# EAGLE design BigLCD_final_rev02 (EAGLE 9.6.2)
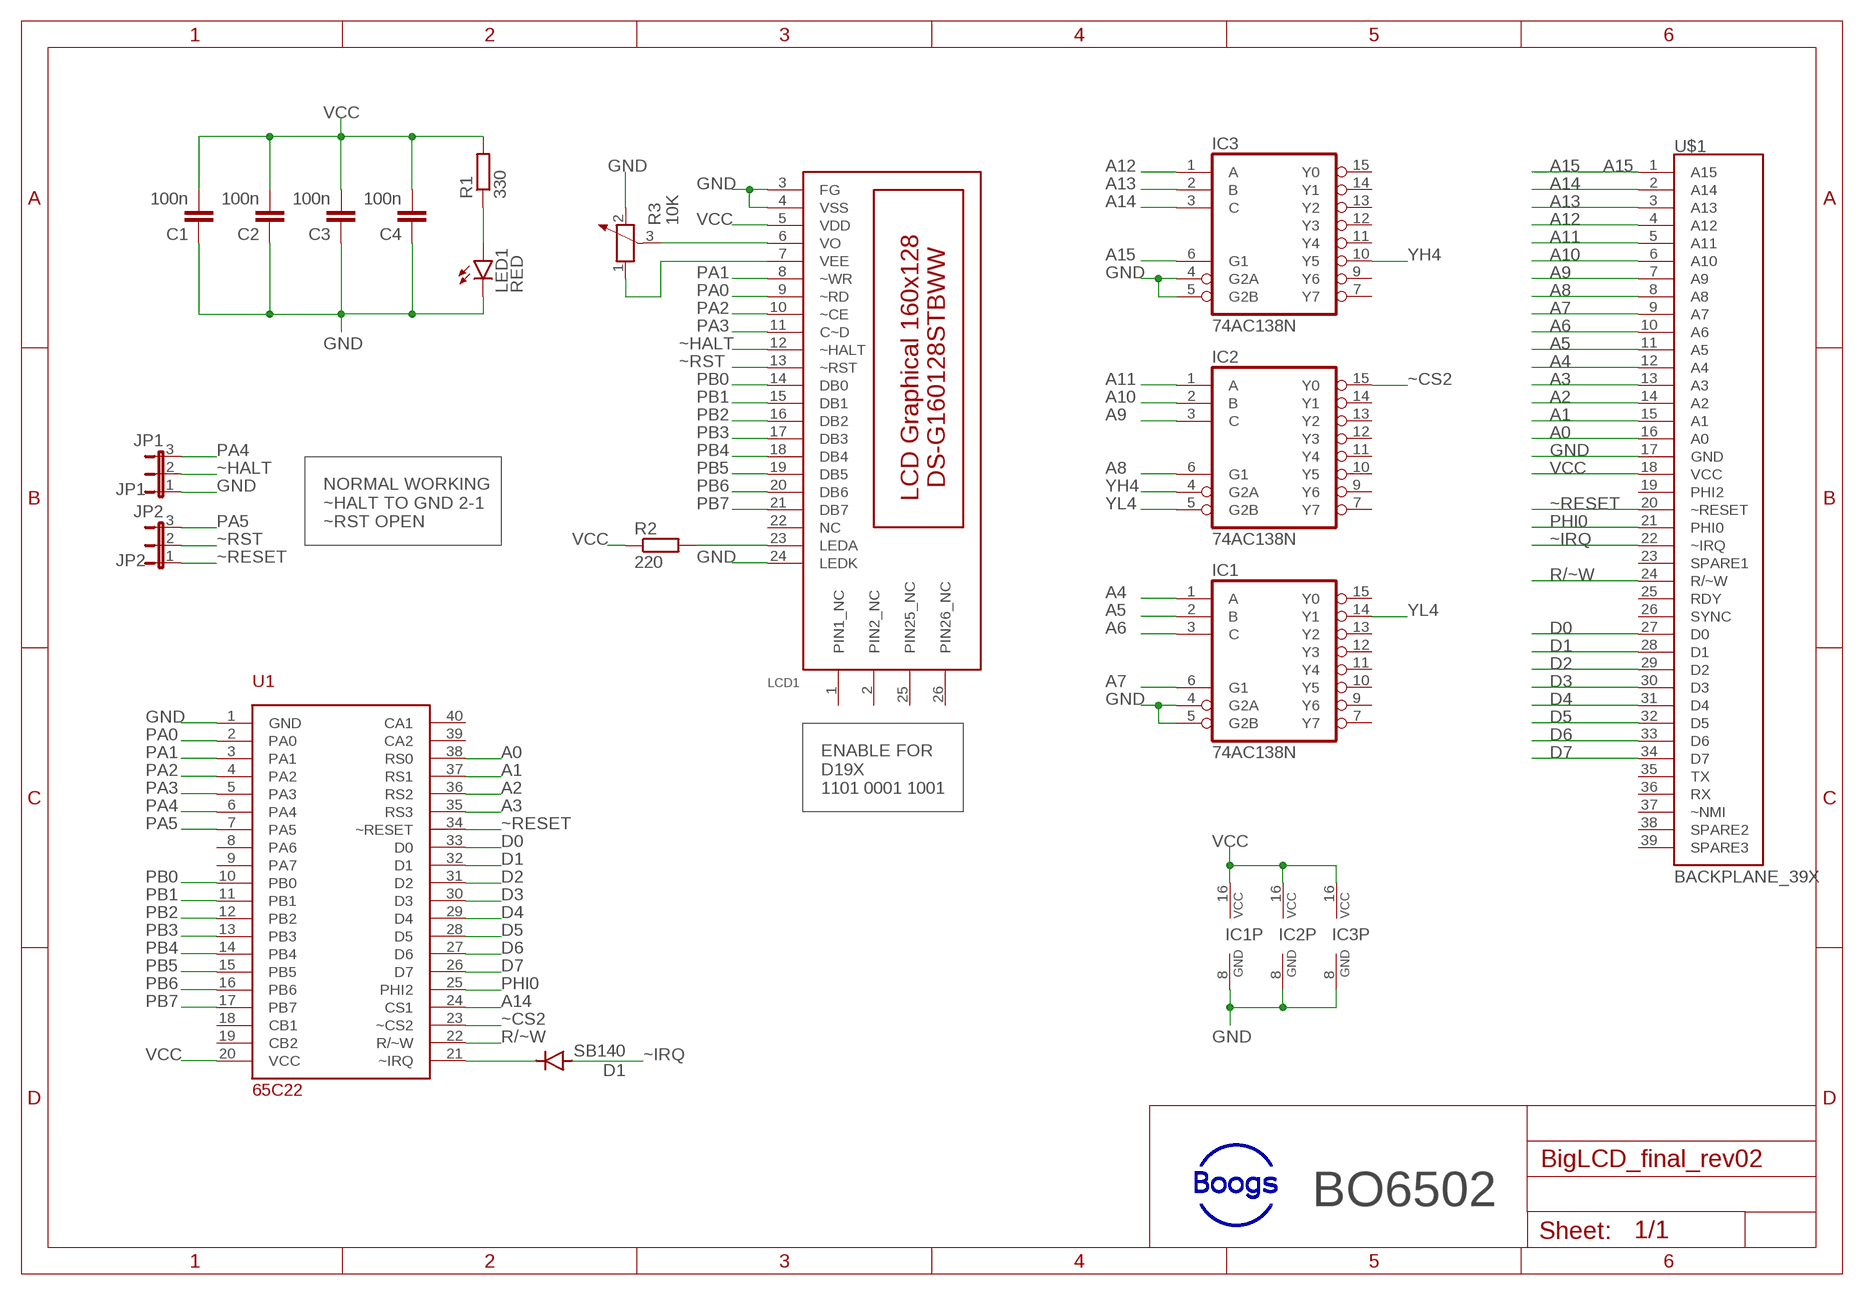
[diagram p0: schematic, sheet 1]

## Parts
C1  100n  C-EU025-025X050  [C025-025X050]
C2  100n  C-EU025-025X050  [C025-025X050]
C3  100n  C-EU025-025X050  [C025-025X050]
C4  100n  C-EU025-025X050  [C025-025X050]
D1  SB140  1N4004  [DO41-10]
IC1  74AC138N  [DIL16]
IC2  74AC138N  [DIL16]
IC3  74AC138N  [DIL16]
JP1  JP1  JP2E  [JP2]
JP2  JP2  JP2E  [JP2]
LCD1  DS-G160128STBWW  [PAK100/2500-26]
LED1  RED  LED5MM  [LED5MM]
R1  330  R-EU_0207/10  [0207/10]
R2  220  R-EU_0207/10  [0207/10]
R3  10K  POTENTIOMETER_PT-10  [PT-10]
U1  65C22  [DIL40]
U$1  BACKPLANE_39X  [BP_39X]

## Nets
A0: U1.38(RS0) U$1.16(A0)
A1: U1.37(RS1) U$1.15(A1)
A2: U1.36(RS2) U$1.14(A2)
A3: U1.35(RS3) U$1.13(A3)
A4: IC1.1(A) U$1.12(A4)
A5: IC1.2(B) U$1.11(A5)
A6: IC1.3(C) U$1.10(A6)
A7: IC1.6(G1) U$1.9(A7)
A8: IC2.6(G1) U$1.8(A8)
A9: IC2.3(C) U$1.7(A9)
A10: IC2.2(B) U$1.6(A10)
A11: IC2.1(A) U$1.5(A11)
A12: IC3.1(A) U$1.4(A12)
A13: IC3.2(B) U$1.3(A13)
A14: IC3.3(C) U1.24(CS1) U$1.2(A14)
A15: IC3.6(G1) U$1.1(A15)
D0: U1.33(D0) U$1.27(D0)
D1: U1.32(D1) U$1.28(D1)
D2: U1.31(D2) U$1.29(D2)
D3: U1.30(D3) U$1.30(D3)
D4: U1.29(D4) U$1.31(D4)
D5: U1.28(D5) U$1.32(D5)
D6: U1.27(D6) U$1.33(D6)
D7: U1.26(D7) U$1.34(D7)
GND: C1.1 C2.1 C3.1 C4.1 IC1.4(G2A) IC1.5(G2B) IC1.8(GND) IC2.8(GND) IC3.4(G2A) IC3.5(G2B) IC3.8(GND) JP1.1 LCD1.3(FG) LCD1.4(VSS) LCD1.24(LEDK) LED1.K(C) R3.2 U1.1(GND) U$1.17(GND)
N$1: D1.C U1.21(~IRQ)
N$2: LCD1.6(VO) R3.3
N$3: LCD1.7(VEE) R3.1
N$4: LCD1.23(LEDA) R2.2
N$6: LED1.A R1.1
PA0: LCD1.9(~RD) U1.2(PA0)
PA1: LCD1.8(~WR) U1.3(PA1)
PA2: LCD1.10(~CE) U1.4(PA2)
PA3: LCD1.11(C~D) U1.5(PA3)
PA4: JP1.3 U1.6(PA4)
PA5: JP2.3 U1.7(PA5)
PB0: LCD1.14(DB0) U1.10(PB0)
PB1: LCD1.15(DB1) U1.11(PB1)
PB2: LCD1.16(DB2) U1.12(PB2)
PB3: LCD1.17(DB3) U1.13(PB3)
PB4: LCD1.18(DB4) U1.14(PB4)
PB5: LCD1.19(DB5) U1.15(PB5)
PB6: LCD1.20(DB6) U1.16(PB6)
PB7: LCD1.21(DB7) U1.17(PB7)
PHI0: U1.25(PHI2) U$1.21(PHI0)
R/~W: U1.22(R/~W) U$1.24(R/~W)
VCC: C1.2 C2.2 C3.2 C4.2 IC1.16(VCC) IC2.16(VCC) IC3.16(VCC) LCD1.5(VDD) R1.2 R2.1 U1.20(VCC) U$1.18(VCC)
YH4: IC2.4(G2A) IC3.10(Y5)
YL4: IC1.14(Y1) IC2.5(G2B)
~CS2: IC2.15(Y0) U1.23(~CS2)
~HALT: JP1.2 LCD1.12(~HALT)
~IRQ: D1.A U$1.22(~IRQ)
~RESET: JP2.1 U1.34(~RESET) U$1.20(~RESET)
~RST: JP2.2 LCD1.13(~RST)
Unconnected: IC1.7(Y7) IC1.9(Y6) IC1.10(Y5) IC1.11(Y4) IC1.12(Y3) IC1.13(Y2) IC1.15(Y0) IC2.7(Y7) IC2.9(Y6) IC2.10(Y5) IC2.11(Y4) IC2.12(Y3) IC2.13(Y2) IC2.14(Y1) IC3.7(Y7) IC3.9(Y6) IC3.11(Y4) IC3.12(Y3) IC3.13(Y2) IC3.14(Y1) IC3.15(Y0) LCD1.1(PIN1_NC) LCD1.2(PIN2_NC) LCD1.22(NC) LCD1.25(PIN25_NC) LCD1.26(PIN26_NC) U1.8(PA6) U1.9(PA7) U1.18(CB1) U1.19(CB2) U1.39(CA2) U1.40(CA1) U$1.19(PHI2) U$1.23(SPARE1) U$1.25(RDY) U$1.26(SYNC) U$1.35(TX) U$1.36(RX) U$1.37(~NMI) U$1.38(SPARE2) U$1.39(SPARE3)

## Notes on the sheet
- NORMAL WORKING
  ~HALT TO GND 2-1
  ~RST OPEN
- ENABLE FOR
  D19X
  1101 0001 1001
- BO6502

## Library data of the parts
C1-C4 = rcl:C-EU: CAPACITOR, European symbol; SPICEPREFIX: C
D1 = diode:1N4004: DIODE general purpose rectifier, 1 A
IC1-IC3 = 74xx-eu:74*138: 3-line to 8-line DECODER/DEMULTIPLEXER
JP1 JP2 = jumper:JP2E: JUMPER
LCD1 = 65xx_family:DS-G160128STBWW
LED1 = led:LED: LED OSRAM: - CHIPLED LG R971, LG N971, LY N971, LG Q971, LY Q971, LO R971, LY R971 LH N974, LH R974 LS Q976, LO Q976, LY Q976 LO Q996 - Hyper CHIPLED LW Q18S LB Q993, LB Q99A, LB R99A - SideLED LS A670, LO A670, LY A670, LG A670, LP A670 LB A673, LV A673, LT A673, LW A673 LH A674 LY A675 LS A676, LA A676, LO A676, LY A676, LW A676 LS A679, LY A679, LG A679 - Hyper Micro SIDELED® LS Y876, LA Y876, LO Y876, LY Y876 LT Y87S - SmartLED LW L88C, LW L88S LB L89C, LB L89S, LG L890 LS L89K, LO L89K, LY L89K LS L896, LA L896, LO L896, LY L896 - TOPLED LS T670, LO T670, LY T670, LG T670, LP T670 LSG T670, LSP T670, LSY T670, LOP T670, LYG T670 LG T671, LOG T671, LSG T671 LB T673, LV T673, LT T673, LW T673 LH T674 LS T676, LA T676, LO T676, LY T676, LB T676, LH T676, LSB T676, LW T676 LB T67C, LV T67C, LT T67C, LS T67K, LO T67K, LY T67K, LW E67C LS E67B, LA E67B, LO E67B, LY E67B, LB E67C, LV E67C, LT E67C LW T67C LS T679, LY T679, LG T679 LS T770, LO T770, LY T770, LG T770, LP T770 LB T773, LV T773, LT T773, LW T773 LH T774 LS E675, LA E675, LY E675, LS T675 LS T776, LA T776, LO T776, LY T776, LB T776 LHGB T686 LT T68C, LB T68C - Hyper Mini TOPLED® LB M676 - Mini TOPLED Santana® LG M470 LS M47K, LO M47K, LY M47K Source: http://www.osram.convergy.de LUXEON: - LUMILED® LXK2-PW12-R00, LXK2-PW12-S00, LXK2-PW14-U00, LXK2-PW14-V00 LXK2-PM12-R00, LXK2-PM12-S00, LXK2-PM14-U00 LXK2-PE12-Q00, LXK2-PE12-R00, LXK2-PE12-S00, LXK2-PE14-T00, LXK2-PE14-U00 LXK2-PB12-K00, LXK2-PB12-L00, LXK2-PB12-M00, LXK2-PB14-N00, LXK2-PB14-P00, LXK2-PB14-Q00 LXK2-PR12-L00, LXK2-PR12-M00, LXK2-PR14-Q00, LXK2-PR14-R00 LXK2-PD12-Q00, LXK2-PD12-R00, LXK2-PD12-S00 LXK2-PH12-R00, LXK2-PH12-S00 LXK2-PL12-P00, LXK2-PL12-Q00, LXK2-PL12-R00 Source: www.luxeon.com KINGBRIGHT: KA-3528ASYC Source: www.kingbright.com
R1 R2 = rcl:R-EU_: RESISTOR, European symbol; SPICEPREFIX: R
R3 = rcl:POTENTIOMETER_: Potentiometer; SPICEMODEL: POT; SPICEPREFIX: X
U1 = 65xx_family:65C22
U$1 = 65xx_family:BACKPLANE_39X; A15: A15

## Board
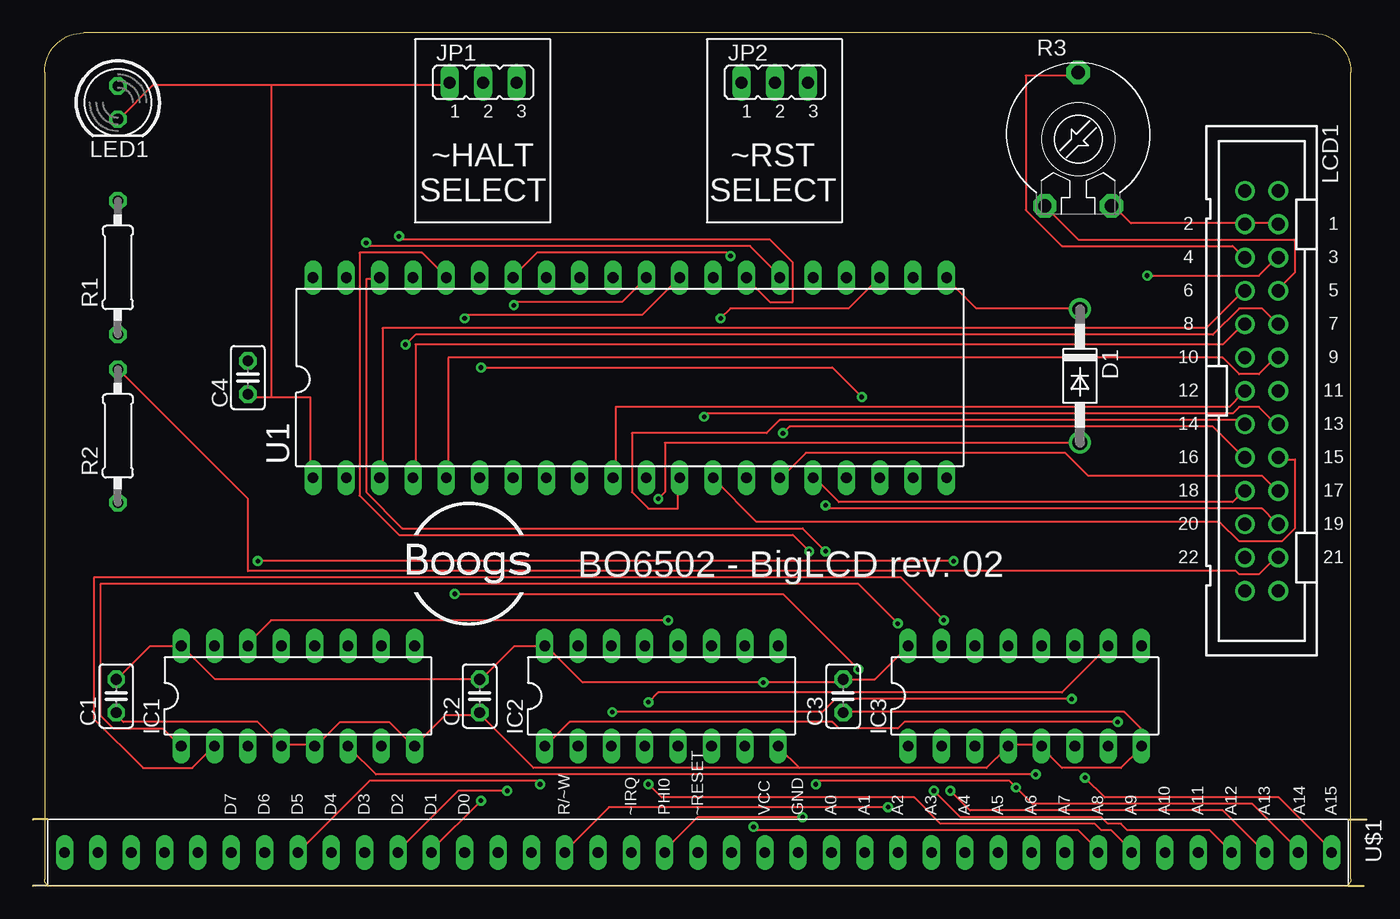
[diagram p1: board, top side]
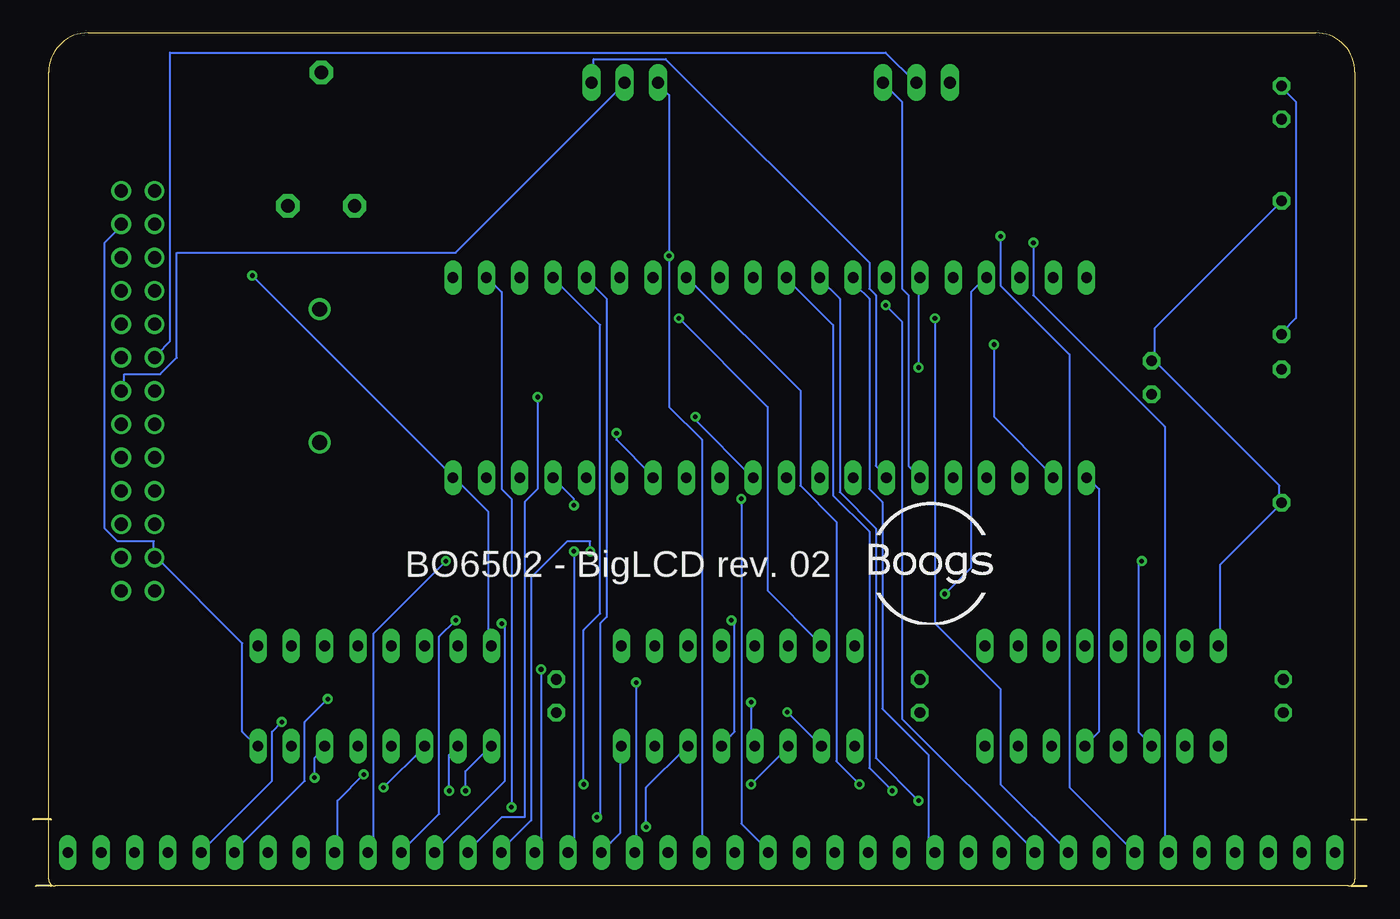
[diagram p2: board, bottom side, seen from below]

Size 101.6 x 65 mm. Coordinates in mm from the lower left corner, seen from the top.
Outline: 1.14,5.08 0,5.08
Outline: 1.14,0 0,0
Outline: 100.2,5.08 101.6,5.08
Outline: 100.2,0 101.35,0
Outline: 1.39,0 99.89,0 arc90 100.39,0.5 100.39,62 arc90 97.39,65 3.89,65 arc90 0.89,62 0.89,0.5 arc90 1.39,0
Copper layers (1*16): Top 0.035mm / dielectric 1.5mm / Bottom 0.035mm
Design rules "default *": minimum track width 6mil, minimum drill 0.35mm, track to track 10mil, track to pad 10mil, pad to pad 10mil, via to via 10mil, smd to smd 6mil, copper to edge 40mil, drill to drill 6mil, minimum pad ring 10mil, minimum via ring 8mil, stop-mask expansion 4mil, vias tented up to drill 15mil, thermal gap 10mil

### Footprints (pad centres in the part's own frame; a part is rotated, then mirrored left to right if it is on the bottom)
C025-025X050 = drill 0.813 octagon: 1 -1.27,0; 2 1.27,0
DO41-10 = drill 1.118: A 5.08,0; C -5.08,0
DIL16 = drill 0.813 long: 1 -8.89,-3.81; 2 -6.35,-3.81; 3 -3.81,-3.81; 4 -1.27,-3.81; 5 1.27,-3.81; 6 3.81,-3.81; 7 6.35,-3.81; 8 8.89,-3.81; 9 8.89,3.81; 10 6.35,3.81; 11 3.81,3.81; 12 1.27,3.81; 13 -1.27,3.81; 14 -3.81,3.81; 15 -6.35,3.81; 16 -8.89,3.81
JP2 = drill 0.914 long: 1 -2.54,0; 2 0,0; 3 2.54,0
PAK100/2500-26 = drill 1 pad 1.422: 1 -15.24,1.27; 2 -15.24,-1.27; 3 -12.7,1.27; 4 -12.7,-1.27; 5 -10.16,1.27; 6 -10.16,-1.27; 7 -7.62,1.27; 8 -7.62,-1.27; 9 -5.08,1.27; 10 -5.08,-1.27; 11 -2.54,1.27; 12 -2.54,-1.27; 13 0,1.27; 14 0,-1.27; 15 2.54,1.27; 16 2.54,-1.27; 17 5.08,1.27; 18 5.08,-1.27; 19 7.62,1.27; 20 7.62,-1.27; 21 10.16,1.27; 22 10.16,-1.27; 23 12.7,1.27; 24 12.7,-1.27; 25 15.24,1.27; 26 15.24,-1.27
LED5MM = drill 0.813 octagon: A -1.27,0; K 1.27,0
0207/10 = drill 0.813 octagon: 1 -5.08,0; 2 5.08,0
PT-10 = drill 1.016 pad 1.778 octagon: 1 -2.54,-5.08; 2 2.54,-5.08; 3 0,5.08
DIL40 = drill 0.813 long: 1 -24.13,-7.62; 2 -21.59,-7.62; 3 -19.05,-7.62; 4 -16.51,-7.62; 5 -13.97,-7.62; 6 -11.43,-7.62; 7 -8.89,-7.62; 8 -6.35,-7.62; 9 -3.81,-7.62; 10 -1.27,-7.62; 11 1.27,-7.62; 12 3.81,-7.62; 13 6.35,-7.62; 14 8.89,-7.62; 15 11.43,-7.62; 16 13.97,-7.62; 17 16.51,-7.62; 18 19.05,-7.62; 19 21.59,-7.62; 20 24.13,-7.62; 21 24.13,7.62; 22 21.59,7.62; 23 19.05,7.62; 24 16.51,7.62; 25 13.97,7.62; 26 11.43,7.62; 27 8.89,7.62; 28 6.35,7.62; 29 3.81,7.62; 30 1.27,7.62; 31 -1.27,7.62; 32 -3.81,7.62; 33 -6.35,7.62; 34 -8.89,7.62; 35 -11.43,7.62; 36 -13.97,7.62; 37 -16.51,7.62; 38 -19.05,7.62; 39 -21.59,7.62; 40 -24.13,7.62
BP_39X = drill 0.813 long: 1 1.27,59.69; 2 1.27,57.15; 3 1.27,54.61; 4 1.27,52.07; 5 1.27,49.53; 6 1.27,46.99; 7 1.27,44.45; 8 1.27,41.91; 9 1.27,39.37; 10 1.27,36.83; 11 1.27,34.29; 12 1.27,31.75; 13 1.27,29.21; 14 1.27,26.67; 15 1.27,24.13; 16 1.27,21.59; 17 1.27,19.05; 18 1.27,16.51; 19 1.27,13.97; 20 1.27,11.43; 21 1.27,8.89; 22 1.27,6.35; 23 1.27,3.81; 24 1.27,1.27; 25 1.27,-1.27; 26 1.27,-3.81; 27 1.27,-6.35; 28 1.27,-8.89; 29 1.27,-11.43; 30 1.27,-13.97; 31 1.27,-16.51; 32 1.27,-19.05; 33 1.27,-21.59; 34 1.27,-24.13; 35 1.27,-26.67; 36 1.27,-29.21; 37 1.27,-31.75; 38 1.27,-34.29; 39 1.27,-36.83

### Placement (x,y rotation side)
C1  6.35,14.48 90 top
C2  34.04,14.48 90 top
C3  61.72,14.48 90 top
C4  16.38,38.73 90 top
D1  79.76,38.86 270 top
IC1  20.19,14.48 0 top
IC2  47.88,14.48 0 top
IC3  75.56,14.48 0 top
JP1  34.29,61.21 0 top
JP2  56.52,61.21 0 top
LCD1  93.6,37.72 270 top
LED1  6.48,59.69 270 top
R1  6.48,47.12 90 top
R2  6.48,34.29 90 top
R3  79.63,56.9 0 top
U1  45.47,38.73 0 top
U$1  39.24,3.81 270 top

### Tracks (layer width: path | path; a pad name or v marks a point on that pad's centre or on a via)
A0  (via drill 0.35)
  Top 0.152: v60.39,25.5 58.64,27.25 28.14,27.25 25.39,30 25.39,46.25 26.39,46.25 U1.38
  Bottom 0.152: v60.39,25.5 60.39,3 60.64,2.75 U$1.16
A1  (via drill 0.35)
  Top 0.152: v62.89,16.5 57.14,22.25 v32.14,22.25
  Bottom 0.152: v62.89,16.5 62.89,3 63.14,2.75 U$1.15 | v32.14,22.25 30.14,24.25 30.14,45.25 29.14,46.25 U1.37
A2  (via drill 0.35)
  Top 0.152: v59.14,25.5 57.89,26.75 27.89,26.75 24.89,29.75 24.89,48.25 29.64,48.25 31.39,46.5 U1.36
  Bottom 0.152: v59.14,25.5 59.14,26.25 60.89,26.25 63.64,23.5 63.64,5 65.89,2.75 U$1.14
A3  (via drill 0.35)
  Top 0.152: v63.14,37.25 60.89,39.5 v34.14,39.5
  Bottom 0.152: v63.14,37.25 63.14,30.25 64.14,29.25 64.14,5.25 65.89,5.25 68.39,2.75 U$1.13 | v34.14,39.5 34.14,46.25 U1.35
A4  (via drill 0.35)
  Top 0.152: v65.89,20 62.89,23 5.14,23 5.14,13 6.14,12 9.89,12 11.14,10.75 IC1.1
  Bottom 0.152: v65.89,20 65.64,19.75 65.64,8 70.89,2.75 U$1.12
A5  (via drill 0.35)
  Top 0.152: v69.39,20.25 66.14,23.5 4.64,23.5 4.64,12.75 8.39,9 12.14,9 13.64,10.5 IC1.2
  Bottom 0.152: v69.39,20.25 70.64,19 70.64,5.5 73.39,2.75 U$1.11
A6  (via drill 0.35)
  Top 0.152: v70.14,24.75 v17.14,24.75
  Bottom 0.152: v17.14,24.75 17.39,24.5 17.39,11.75 16.39,10.75 IC1.3 | v70.14,24.75 75.64,19.25 75.64,3 75.89,2.75 U$1.10
A7  (via drill 0.35)
  Top 0.152: v76.39,8.5 26.14,8.5 24.14,10.5 IC1.6
  Bottom 0.152: v76.39,8.5 78.39,6.5 78.39,2.75 U$1.9
A8  (via drill 0.35)
  Top 0.152: v54.89,4.5 55.14,4.25 79.64,4.25 81.14,2.75 U$1.8
  Bottom 0.152: v54.89,4.5 54.89,7.5 51.89,10.5 IC2.6
A9  (via drill 0.35)
  Top 0.152: v46.89,7.75 47.89,6.75 67.14,6.75 69.14,4.75 80.89,4.75 81.39,4.25 82.14,4.25 83.64,2.75 U$1.7
  Bottom 0.152: v46.89,7.75 44.14,10.5 IC2.3
A10  (via drill 0.35)
  Top 0.152: v44.14,13.25 60.14,13.25 61.14,14.25 v79.14,14.25
  Bottom 0.152: v44.14,13.25 41.64,10.75 IC2.2 | v79.14,14.25 80.89,12.5 80.89,8 86.14,2.75 U$1.6
A11  (via drill 0.35)
  Top 0.152: v82.64,12.5 66.39,12.5 65.89,12 61.39,12 60.89,12.5 40.89,12.5 39.14,10.75 IC2.1
  Bottom 0.152: v82.64,12.5 83.39,11.75 83.39,8 88.64,2.75 U$1.5
A12  (via drill 0.35)
  Top 0.152: v68.64,7.25 70.64,5.25 81.39,5.25 81.89,4.75 82.89,4.75 83.39,4.25 89.64,4.25 91.14,2.75 U$1.4
  Bottom 0.152: v68.64,7.25 68.64,8.75 66.89,10.5 IC3.1
A13  (via drill 0.35)
  Top 0.152: v69.89,7.25 71.39,5.75 90.64,5.75 93.64,2.75 U$1.3
  Bottom 0.152: v69.89,7.25 69.89,10 69.39,10.5 IC3.2
A14  (via drill 0.35)
  Top 0.152: U$1.2 96.39,2.75 92.89,6.25 76.14,6.25 v74.89,7.5 74.39,8 59.89,8 v59.64,7.75
  Bottom 0.152: v74.89,7.5 71.89,10.5 IC3.3 | v59.64,7.75 59.64,19.5 58.39,20.75 58.39,42.75 61.89,46.25 U1.24
A15  (via drill 0.35)
  Top 0.152: v80.14,8.25 81.64,6.75 94.89,6.75 98.89,2.75 U$1.1
  Bottom 0.152: v80.14,8.25 80.14,9.75 79.39,10.5 IC3.6
D0
  Bottom 0.152: U$1.27 33.14,2.75 33.39,3 33.39,10 36.89,13.5 36.89,29.25 37.89,30.25 37.89,44.75 38.89,45.75 38.89,46.25 U1.33
D1  (via drill 0.35)
  Top 0.152: v34.14,6.5 30.39,2.75 U$1.28
  Bottom 0.152: v34.14,6.5 37.39,9.75 37.39,27.25 40.14,30 40.14,44.75 41.64,46.25 U1.32
D2  (via drill 0.35)
  Top 0.152: v36.14,7.25 32.39,7.25 27.89,2.75 U$1.29
  Bottom 0.152: v36.14,7.25 37.89,9 37.89,27 40.64,29.75 40.64,42.75 44.14,46.25 U1.31
D3  (via drill 0.35)
  Top 0.152: v36.64,44.25 36.89,44.5 44.89,44.5 46.64,46.25 U1.30
  Bottom 0.152: v36.64,44.25 35.39,43 35.39,12.75 25.39,2.75 U$1.30
D4  (via drill 0.35)
  Top 0.152: v32.89,43.25 33.14,43.5 46.39,43.5 49.14,46.25 U1.29
  Bottom 0.152: v32.89,43.25 32.89,20 27.89,15 27.89,7.75 22.89,2.75 U$1.31
D5  (via drill 0.35)
  Top 0.152: v38.64,7.75 38.39,8 25.64,8 20.39,2.75 U$1.32
  Bottom 0.152: v38.64,7.75 40.39,9.5 40.39,27.75 43.14,30.5 43.14,37.75 51.64,46.25 U1.28
D6  (via drill 0.35)
  Top 0.152: v27.89,49.5 28.14,49.25 56.14,49.25 57.89,47.5 57.89,44.5 56.14,44.5 54.39,46.25 U1.27
  Bottom 0.152: v27.89,49.5 27.89,45.75 22.64,40.5 22.64,7.5 17.89,2.75 U$1.33
D7  (via drill 0.35)
  Top 0.152: v25.39,49 25.64,48.75 54.64,48.75 56.89,46.5 U1.26
  Bottom 0.152: v25.39,49 25.39,45 15.39,35 15.39,3 15.14,2.75 U$1.34
GND
  Top 0.152: C1.1 6.39,13 6.89,12.5 17.14,12.5 18.89,10.75 IC1.4 19.14,10.75 21.39,10.75 IC1.5 21.64,10.75 23.39,12.5 27.14,12.5 28.89,10.75 IC1.8 29.14,10.75 31.39,13 33.89,13 C2.1 34.14,13 38.14,9 58.39,9 | 18.14,37.25 16.39,37.25 C4.1 | 18.14,37.25 21.14,37.25 21.14,31.25 U1.1 | 18.14,61 31.64,61 JP1.1 | 18.14,61 9.14,61 6.64,58.5 LED1.K | 18.14,61 18.14,37.25 | LCD1.3 94.64,50.5 92.39,50.5 LCD1.4 92.14,50.5 83.64,50.5 82.39,51.75 R3.2 | C3.1 61.89,13.25 83.14,13.25 84.39,12 84.39,10.75 IC3.8 84.39,10.5 82.89,9 78.39,9 76.89,10.5 IC3.5 76.64,10.75 74.39,10.75 IC3.4 74.14,10.5 72.64,9 58.39,9 | 58.39,9 56.89,10.5 IC2.8
  Bottom 0.152: IC1.5 21.39,10.75 20.39,11.75 20.39,30.25 21.14,31 U1.1 | U$1.17 58.14,2.75 56.89,4 56.89,10.5 IC2.8 | IC3.8 84.64,10.75 85.64,11.75 85.64,18.5 92.14,25 LCD1.24 92.39,25.25 92.39,26.25 95.14,26.25 96.14,27.25 96.14,49 94.89,50.25 LCD1.3
N$1
  Top 0.152: U1.21 69.64,46.25 71.89,44 79.64,44 D1.C
N$2
  Top 0.152: LCD1.6 92.14,48 91.39,48.75 78.39,48.75 75.64,51.5 75.64,61.75 79.39,61.75 R3.3
N$3
  Top 0.152: LCD1.7 94.89,45.5 96.14,46.75 96.14,49.25 79.64,49.25 77.14,51.75 R3.1
N$4
  Top 0.152: R2.2 6.64,39.25 16.39,29.5 16.39,24 91.64,24 91.89,23.75 93.39,23.75 94.64,25 LCD1.23
N$6
  Bottom 0.152: R1.1 6.39,42.25 5.39,43.25 5.39,59.75 6.39,60.75 LED1.A
PA0  (via drill 0.35)
  Top 0.152: v28.39,41.25 29.14,42 89.89,42 91.89,44 93.64,44 94.64,43 LCD1.9
  Bottom 0.152: v28.39,41.25 28.39,35.75 23.89,31.25 U1.2
PA1
  Top 0.152: U1.3 26.64,31.25 26.64,42.5 89.39,42.5 92.14,45.25 LCD1.8
PA2
  Top 0.152: U1.4 29.14,31.25 29.14,41.25 90.64,41.25 92.14,42.75 LCD1.10
PA3
  Top 0.152: U1.5 31.64,31.25 31.64,40.25 90.64,40.25 91.89,39 93.39,39 94.64,40.25 LCD1.11
PA4
  Bottom 0.152: U1.6 34.14,31.25 34.89,32 34.89,45 35.39,45.5 35.39,59.75 36.64,61 JP1.3
PA5
  Bottom 0.152: U1.7 36.64,31.25 37.39,32 37.39,45 37.89,45.5 37.89,47.5 53.39,63 58.89,63 58.89,61.25 JP2.3
PB0
  Top 0.152: U1.10 44.39,31.25 44.39,36.5 91.14,36.5 92.14,37.5 LCD1.14
PB1  (via drill 0.35)
  Top 0.152: v51.14,35.75 51.39,36 91.39,36 91.89,36.5 93.39,36.5 94.64,35.25 LCD1.15
  Bottom 0.152: v51.14,35.75 51.14,35.5 46.89,31.25 U1.11
PB2
  Top 0.152: U1.12 49.14,31 49.14,28.75 46.89,28.75 45.64,30 45.64,34.5 55.89,34.5 56.89,35.5 91.89,35.5 92.14,35.25 LCD1.16
PB3
  Top 0.152: U1.13 51.89,31 55.14,27.75 90.39,27.75 91.89,26.25 95.14,26.25 96.14,27.25 96.14,32.5 94.89,32.5 LCD1.17
PB4  (via drill 0.35)
  Top 0.152: v57.14,34.5 57.64,35 89.89,35 92.14,32.75 LCD1.18
  Bottom 0.152: v57.14,34.5 57.14,34 54.39,31.25 U1.14
PB5
  Top 0.152: U1.15 57.14,31.25 58.89,33 78.64,33 80.39,31.25 93.64,31.25 94.64,30.25 LCD1.19
PB6
  Top 0.152: U1.16 59.64,31 61.39,29.25 91.39,29.25 92.14,30 LCD1.20
PB7  (via drill 0.35)
  Top 0.152: v60.39,29 60.64,28.75 93.64,28.75 94.64,27.75 LCD1.21
  Bottom 0.152: v60.39,29 60.39,29.5 61.89,31 U1.17
PHI0  (via drill 0.35)
  Top 0.152: v58.64,5.25 50.64,5.25 48.14,2.75 U$1.21
  Bottom 0.152: v58.64,5.25 58.39,5.5 58.39,20 57.89,20.5 57.89,44.75 59.39,46.25 U1.25
R/~W  (via drill 0.35)
  Top 0.152: v65.14,6 43.89,6 40.64,2.75 U$1.24
  Bottom 0.152: v65.14,6 65.14,29.5 65.89,30.25 65.89,45.25 66.89,46.25 U1.22
VCC  (via drill 0.35)
  Top 0.152: C1.2 6.39,15.75 8.89,18.25 11.14,18.25 IC1.16 11.39,18.25 13.89,15.75 33.89,15.75 C2.2 34.14,15.75 36.64,18.25 38.89,18.25 IC2.16 39.14,18.25 41.89,15.5 v55.64,15.5 61.64,15.5 C3.2 61.89,15.75 64.14,15.75 66.64,18.25 IC3.16 | v84.89,46.5 93.39,46.5 94.64,47.75 LCD1.5
  Bottom 0.152: IC1.16 11.14,18.5 11.14,24.5 6.64,29 R2.1 6.64,29.25 6.64,30.5 16.14,40 C4.2 16.14,40.25 16.14,42.5 6.64,52 R1.2 | v55.64,15.5 55.64,2.75 U$1.18 | IC3.16 66.89,18.5 66.89,28.5 69.39,31 U1.20 69.64,31.25 v84.89,46.5
YH4  (via drill 0.35)
  Top 0.152: v46.89,14 47.64,14.75 78.39,14.75 81.89,18.25 IC3.10
  Bottom 0.152: v46.89,14 46.89,11 46.64,10.75 IC2.4
YL4  (via drill 0.35)
  Top 0.152: v48.39,20.25 18.14,20.25 16.39,18.5 IC1.14
  Bottom 0.152: v48.39,20.25 48.14,20 48.14,11.75 49.14,10.75 IC2.5
~CS2  (via drill 0.35)
  Top 0.152: v52.39,43.25 53.14,44 62.14,44 64.39,46.25 U1.23
  Bottom 0.152: v52.39,43.25 45.64,36.5 45.64,22.5 41.64,18.5 IC2.15
~HALT
  Bottom 0.152: JP1.2 34.39,61.25 36.64,63.5 91.14,63.5 91.14,41.5 92.14,40.5 LCD1.12
~IRQ  (via drill 0.35)
  Top 0.152: v47.64,29.5 48.14,30 48.14,33.75 79.64,33.75 D1.A
  Bottom 0.152: v47.64,29.5 47.64,4.75 45.64,2.75 U$1.22
~RESET  (via drill 0.35)
  Top 0.152: v53.14,48 52.89,48.25 38.39,48.25 36.64,46.5 U1.34
  Bottom 0.152: U$1.20 50.64,2.75 50.64,34 53.14,36.5 v53.14,48 53.14,60.25 53.89,61 JP2.1
~RST
  Bottom 0.152: JP2.2 56.64,61 69.39,48.25 90.64,48.25 90.64,40.25 91.89,39 94.64,39 94.64,37.75 LCD1.13

### Text on the board
tNames: ~HALT / SELECT | ~RST / SELECT | 2 | 1 | 4 | 3 | 6 | 5 | 8 | 7 | 10 | 9 | 12 | 11 | 14 | 13 | 16 | 15 | 18 | 17 | 20 | 19 | 22 | 21 | BO6502 - BigLCD rev. 02 | D7 | D6 | D5 | D4 | D3 | D2 | D1 | D0 | R/~W | ~IRQ | PHI0 | ~RESET | VCC | GND | A0 | A1 | A2 | A3 | A4 | A5 | A6 | A7 | A8 | A9 | A10 | A11 | A12 | A13 | A14 | A15
bNames: BO6502 - BigLCD rev. 02